# EAGLE design Mecanumbot Power Board (EAGLE 6.2)
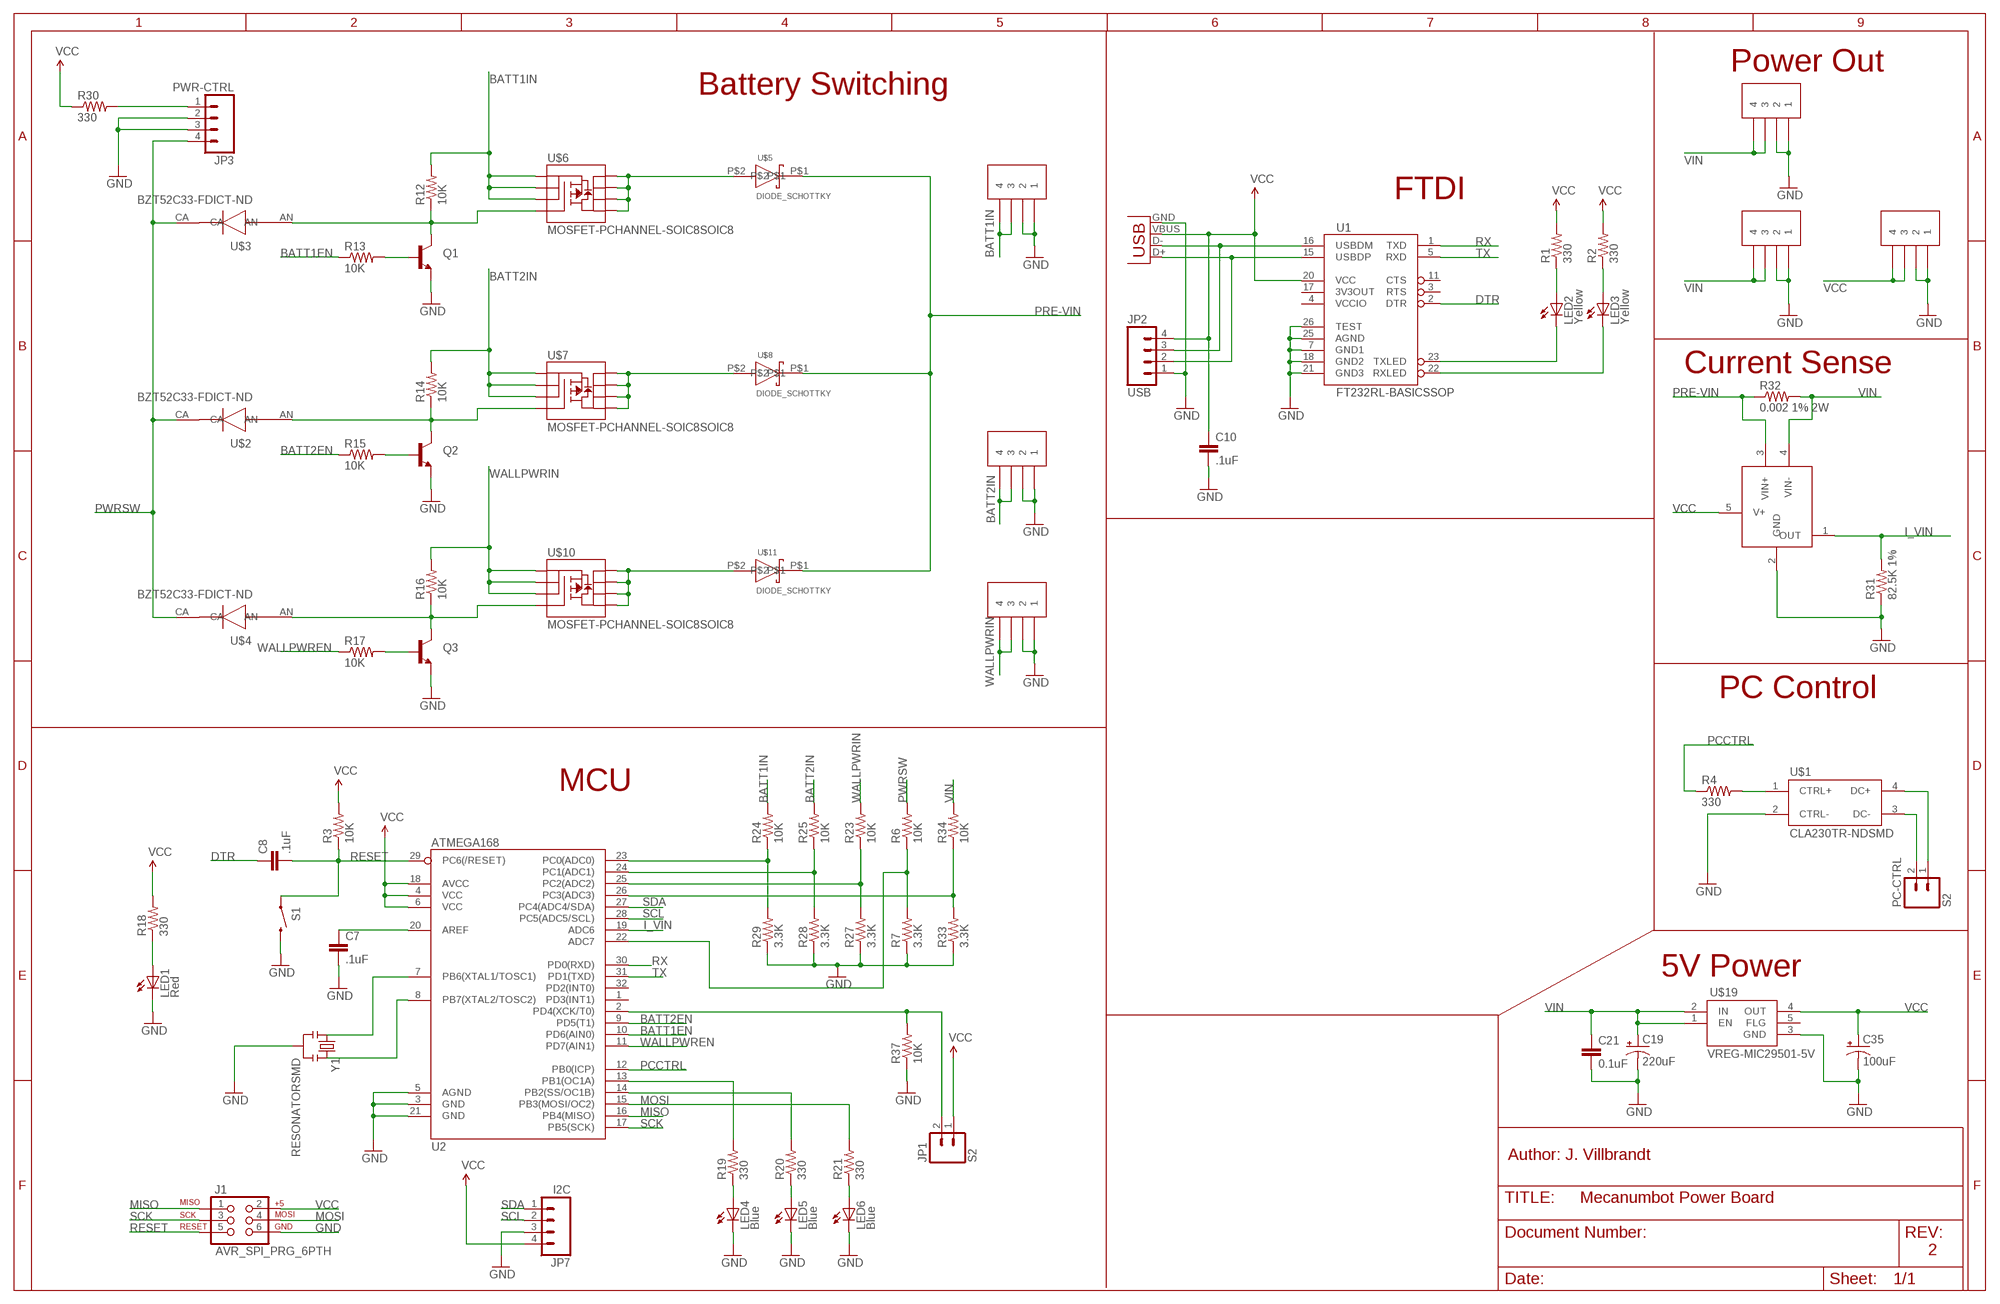
[diagram p0: schematic, sheet 1]

## Parts
C7  .1uF  CAP0603-CAP  [0603-CAP]
C8  .1uF  CAP0603-CAP  [0603-CAP]
C10  .1uF  CAP0603-CAP  [0603-CAP]
C19  220uF  CAP_POLPTH4  [CPOL-RADIAL-1000UF-25V]
C21  0.1uF  CAP1206  [1206]
C35  100uF  CAP_POL1206  [EIA3216]
J1  AVR_SPI_PRG_6PTH  [2X3]
JP1  S2  M02PTH  [1X02]
JP2  USB  M04PTH  [1X04]
JP3  PWR-CTRL  M04PTH  [1X04]
JP7  I2C  M04PTH  [1X04]
LED1  Red  LED0603  [LED-0603]
LED2  Yellow  LED0603  [LED-0603]
LED3  Yellow  LED0603  [LED-0603]
LED4  Blue  LED0603  [LED-0603]
LED5  Blue  LED0603  [LED-0603]
LED6  Blue  LED0603  [LED-0603]
PC-CTRL  S2  M02PTH  [1X02]
Q1  TRANSISTOR_NPNSOT23  [SOT23]
Q2  TRANSISTOR_NPNSOT23  [SOT23]
Q3  TRANSISTOR_NPNSOT23  [SOT23]
R1  330  RESISTOR0603-RES  [0603-RES]
R2  330  RESISTOR0603-RES  [0603-RES]
R3  10K  RESISTOR0603-RES  [0603-RES]
R4  330  RESISTOR0603-RES  [0603-RES]
R6  10K  RESISTOR0603-RES  [0603-RES]
R7  3.3K  RESISTOR0603-RES  [0603-RES]
R12  10K  RESISTOR0603-RES  [0603-RES]
R13  10K  RESISTOR0603-RES  [0603-RES]
R14  10K  RESISTOR0603-RES  [0603-RES]
R15  10K  RESISTOR0603-RES  [0603-RES]
R16  10K  RESISTOR0603-RES  [0603-RES]
R17  10K  RESISTOR0603-RES  [0603-RES]
R18  330  RESISTOR0603-RES  [0603-RES]
R19  330  RESISTOR0603-RES  [0603-RES]
R20  330  RESISTOR0603-RES  [0603-RES]
R21  330  RESISTOR0603-RES  [0603-RES]
R23  10K  RESISTOR0603-RES  [0603-RES]
R24  10K  RESISTOR0603-RES  [0603-RES]
R25  10K  RESISTOR0603-RES  [0603-RES]
R27  3.3K  RESISTOR0603-RES  [0603-RES]
R28  3.3K  RESISTOR0603-RES  [0603-RES]
R29  3.3K  RESISTOR0603-RES  [0603-RES]
R30  330  RESISTOR0603-RES  [0603-RES]
R31  82.5K 1%  RESISTOR0603-RES  [0603-RES]
R32  0.002 1% 2W  RESISTOR2512  [R2512]
R33  3.3K  RESISTOR0603-RES  [0603-RES]
R34  10K  RESISTOR0603-RES  [0603-RES]
R37  10K  RESISTOR0603-RES  [0603-RES]
S1  reset  SWITCH-MOMENTARY-2SMD  [TACTILE_SWITCH_SMD]
U1  FT232RL-BASICSSOP  [SSOP28DB]
U2  ATMEGA168  [TQFP32-08]
U$1  CLA230TR-NDSMD  [4-SOP]
U$2  BZT52C33-FDICT-ND  [SOD-123]
U$3  BZT52C33-FDICT-ND  [SOD-123]
U$4  BZT52C33-FDICT-ND  [SOD-123]
U$5  DIODE_SCHOTTKY  [DO214AB]
U$6  MOSFET-PCHANNEL-SOIC8SOIC8  [SO08]
U$7  MOSFET-PCHANNEL-SOIC8SOIC8  [SO08]
U$8  DIODE_SCHOTTKY  [DO214AB]
U$10  MOSFET-PCHANNEL-SOIC8SOIC8  [SO08]
U$11  DIODE_SCHOTTKY  [DO214AB]
U$12  TERMINAL-4MINIFIT-JR  [MINIFITJR-RGT-4]
U$13  TERMINAL-4MINIFIT-JR  [MINIFITJR-RGT-4]
U$14  TERMINAL-4MINIFIT-JR  [MINIFITJR-RGT-4]
U$16  TERMINAL-4MINIFIT-JR  [MINIFITJR-RGT-4]
U$17  TERMINAL-4MINIFIT-JR  [MINIFITJR-RGT-4]
U$18  TERMINAL-4MINIFIT-JR  [MINIFITJR-RGT-4]
U$19  VREG-MIC29501-5V  [TO263-5]
U$20  INA139/169SOT23-5  [SOT23-5]
X1  USBSMD  [USB-MINIB]
Y1  RESONATORSMD  [RESONATOR-SMD]

## Nets
BATT1EN: R13.1 U2.10(PD6(AIN0))
BATT1IN: R12.2 R24.2 U$6.1(S) U$6.2(S) U$6.3(S) U$12.3 U$12.4
BATT1PREDIODE: U$5.P$2 U$6.5(D) U$6.6(D) U$6.7(D) U$6.8(D)
BATT2EN: R15.1 U2.9(PD5(T1))
BATT2IN: R14.2 R25.2 U$7.1(S) U$7.2(S) U$7.3(S) U$13.3 U$13.4
BATT2PREDIODE: U$7.5(D) U$7.6(D) U$7.7(D) U$7.8(D) U$8.P$2
DTR: C8.1 U1.2(DTR)
GND: C7.2 C10.2 C19.2(-) C21.2 C35.C(-) J1.6 JP2.1 JP3.2 JP3.3 JP7.3 LED1.C LED4.C LED5.C LED6.C Q1.2(E) Q2.2(E) Q3.2(E) R7.1 R27.1 R28.1 R29.1 R31.1 R33.1 R37.1 S1.3 U1.7(GND1) U1.18(GND2) U1.21(GND3) U1.25(AGND) U1.26(TEST) U2.3(GND) U2.5(AGND) U2.21(GND) U$1.2(CTRL-) U$12.1 U$12.2 U$13.1 U$13.2 U$14.1 U$14.2 U$16.1 U$16.2 U$17.1 U$17.2 U$18.1 U$18.2 U$19.3(GND) U$20.2(GND) X1.GND Y1.2
I_VIN: R31.2 U2.19(ADC6) U$20.1(OUT)
MISO: J1.1 U2.16(PB4(MISO))
MOSI: J1.4 R21.2 U2.15(PB3(MOSI/OC2))
N$1: LED2.A R1.1
N$2: LED3.A R2.1
N$3: LED2.C U1.23(TXLED)
N$4: LED3.C U1.22(RXLED)
N$5: PC-CTRL.2 U$1.3(DC-)
N$6: PC-CTRL.1 U$1.4(DC+)
N$7: JP2.3 U1.16(USBDM) X1.D-
N$8: JP2.2 U1.15(USBDP) X1.D+
N$9: C7.1 U2.20(AREF)
N$10: U2.7(PB6(XTAL1/TOSC1)) Y1.1
N$11: U2.8(PB7(XTAL2/TOSC2)) Y1.3
N$12: R4.2 U$1.1(CTRL+)
N$13: JP3.1 R30.2
N$14: R20.2 U2.14(PB2(SS/OC1B))
N$15: R33.2 R34.1 U2.26(PC3(ADC3))
N$16: R19.2 U2.13(PB1(OC1A))
N$20: JP1.2 R37.2 U2.2(PD4(XCK/T0))
N$26: Q1.3(C) R12.1 U$3.AN U$6.4(G)
N$27: Q1.1(B) R13.2
N$29: Q2.3(C) R14.1 U$2.AN U$7.4(G)
N$30: Q2.1(B) R15.2
N$31: LED1.A R18.1
N$32: Q3.3(C) R16.1 U$4.AN U$10.4(G)
N$33: Q3.1(B) R17.2
N$38: LED6.A R21.1
N$39: LED4.A R19.1
N$40: LED5.A R20.1
N$42: R23.1 R27.2 U2.25(PC2(ADC2))
N$43: R25.1 R28.2 U2.24(PC1(ADC1))
N$44: R24.1 R29.2 U2.23(PC0(ADC0))
N$46: R6.1 R7.2 U2.22(ADC7)
PCCTRL: R4.1 U2.12(PB0(ICP))
PRE-VIN: R32.1 U$5.P$1 U$8.P$1 U$11.P$1 U$20.3(VIN+)
PWRSW: JP3.4 R6.2 U$2.CA U$3.CA U$4.CA
RESET: C8.2 J1.5 R3.1 S1.1 U2.29(PC6(/RESET))
RX: U1.1(TXD) U2.30(PD0(RXD))
SCK: J1.3 U2.17(PB5(SCK))
SCL: JP7.2 U2.28(PC5(ADC5/SCL))
SDA: JP7.1 U2.27(PC4(ADC4/SDA))
TX: U1.5(RXD) U2.31(PD1(TXD))
VCC: C10.1 C35.A(+) J1.2 JP1.1 JP2.4 JP7.4 R1.2 R2.2 R3.2 R18.2 R30.1 U1.20(VCC) U2.4(VCC) U2.6(VCC) U2.18(AVCC) U$18.3 U$18.4 U$19.4(OUT) U$20.5(V+) X1.VBUS
VIN: C19.1(+) C21.1 R32.2 R34.2 U$16.3 U$16.4 U$17.3 U$17.4 U$19.1(EN) U$19.2(IN) U$20.4(VIN-)
WALLPWREN: R17.1 U2.11(PD7(AIN1))
WALLPWRIN: R16.2 R23.2 U$10.1(S) U$10.2(S) U$10.3(S) U$14.3 U$14.4
WALLPWRPREDIODE: U$10.5(D) U$10.6(D) U$10.7(D) U$10.8(D) U$11.P$2
Unconnected: U1.3(RTS) U1.11(CTS) U1.17(3V3OUT) U2.1(PD3(INT1)) U2.32(PD2(INT0)) U$19.5(FLG)

## Notes on the sheet
- Power Out
- Battery Switching
- FTDI
- Current Sense
- PC Control
- MCU
- 5V Power
- Author: J. Villbrandt
- 2

## Power pins joined to a net without a drawn wire
VCCIO: U1.4(VCCIO)

## Library data of the parts
C7 C8 C10 = SparkFun:CAP: Capacitor Standard 0603 ceramic capacitor, and 0.1" leaded capacitor.
C19 = SparkFun2:CAP_POL: Capacitor Polarized These are standard SMD and PTH capacitors. Normally 10uF, 47uF, and 100uF in electrolytic and tantalum varieties. Always verify the external diameter of the through hole cap, it varies with capacity, voltage, and manufacturer. The EIA devices should be standard.
C21 = SparkFun2:CAP: Capacitor Standard 0603 ceramic capacitor, and 0.1" leaded capacitor.
C35 = SparkFun:CAP_POL: Capacitor Polarized These are standard SMD and PTH capacitors. Normally 10uF, 47uF, and 100uF in electrolytic and tantalum varieties. Always verify the external diameter of the through hole cap, it varies with capacity, voltage, and manufacturer. The EIA devices should be standard.
J1 = SparkFun:AVR_SPI_PRG_6: AVR ISP 6 Pin This is the reduced ISP connector for AVR programming. Common on Arduino. This footprint will take up less PCB space and can be used with a 10-pin to 6-pin adapter such as SKU: BOB-08508
JP1 PC-CTRL = SparkFun:M02: Header 2 Standard 2-pin 0.1" header. Use with straight break away headers (SKU : PRT-00116), right angle break away headers (PRT-00553), swiss pins (PRT-00743), machine pins (PRT-00117), and female headers (PRT-00115). Molex polarized connector foot print use with SKU : PRT-08233 with associated crimp pins and housings.
JP2 JP3 JP7 = SparkFun:M04: Header 4 Standard 4-pin 0.1" header. Use with straight break away headers (SKU : PRT-00116), right angle break away headers (PRT-00553), swiss pins (PRT-00743), machine pins (PRT-00117), and female headers (PRT-00115). Molex polarized connector foot print use with SKU : PRT-08231 with associated crimp pins and housings. 1MM SMD Version SKU: PRT-10208
LED1-LED6 = SparkFun:LED: LEDs Standard schematic elements and footprints for 5mm, 3mm, 1206, and 0603 sized LEDs. 5mm - Spark Fun Electronics SKU : COM-00529 (and others)
Q1-Q3 = SparkFun:TRANSISTOR_NPN: Transistor NPN BJT configuration in SOT23 package. MMBT2222 is the common NPN we use. Double check BCE configuration again layout.
R1-R4 R6 R7 R12-R21 R23-R25 R27-R34 R37 = SparkFun:RESISTOR: Resistor Basic schematic elements and footprints for 0603, 1206, and PTH resistors.
S1 = SparkFun:SWITCH-MOMENTARY-2
U1 = SparkFun:FT232RL-BASIC: USB UART This is the simplified version of the FT232RL unit. Only what you need, nothing you don't. Spark Fun Electronics SKU : COM-00650
U2 = SparkFun:ATMEGA168
U$1 = jav-parts:CLA230TR-ND: Digi-Key part: CLA230TR-ND http://www.digikey.com/product-detail/en/CPC1002NTR/CLA230TR-ND/1023460 http://www.clare.com/home/pdfs.nsf/www/CPC1002N.pdf/$file/CPC1002N.pdf
U$2-U$4 = jav-parts:BZT52C33-FDICT-ND: 33V Zener Diode, 500mW Digi-Key part: BZT52C33-FDICT-ND http://www.digikey.com/product-detail/en/BZT52C33-7-F/BZT52C33-FDICT-ND/717852 http://www.diodes.com/datasheets/ds18004.pdf
U$5 U$8 U$11 = AT-Parts-RJ:DIODE_SCHOTTKY
U$6 U$7 U$10 = SparkFun:MOSFET-PCHANNEL-SOIC8
U$12-U$14 U$16-U$18 = AT-Parts-RJ:TERMINAL-4
U$19 = RJehangir:VREG-MIC29501-5V
U$20 = AT-Parts-RJ:INA139/169: TI High-Side Measurement: CURRENT SHUNT MONITOR
X1 = SparkFun:USB: USB Connectors USB-B-PTH is fully proven SKU : PRT-00139 USB-miniB is fully proven SKU : PRT-00587 USB-A-PCB is untested. USB-A-H is throughly reviewed, but untested. Spark Fun Electronics SKU : PRT-00437 USB-B-SMT is throughly reviewed, but untested. Needs silkscreen touching up. USB-A-S has not been used/tested USB-MB-H has not been used/tested
Y1 = SparkFun:RESONATOR: Resonator Small SMD resonator. This is the itty bitty 10/20MHz resonators with built in caps. CSTCE10M0G55 and CSTCE20M0V53. Footprint has been reviewed closely but hasn't been tested yet.

## Board
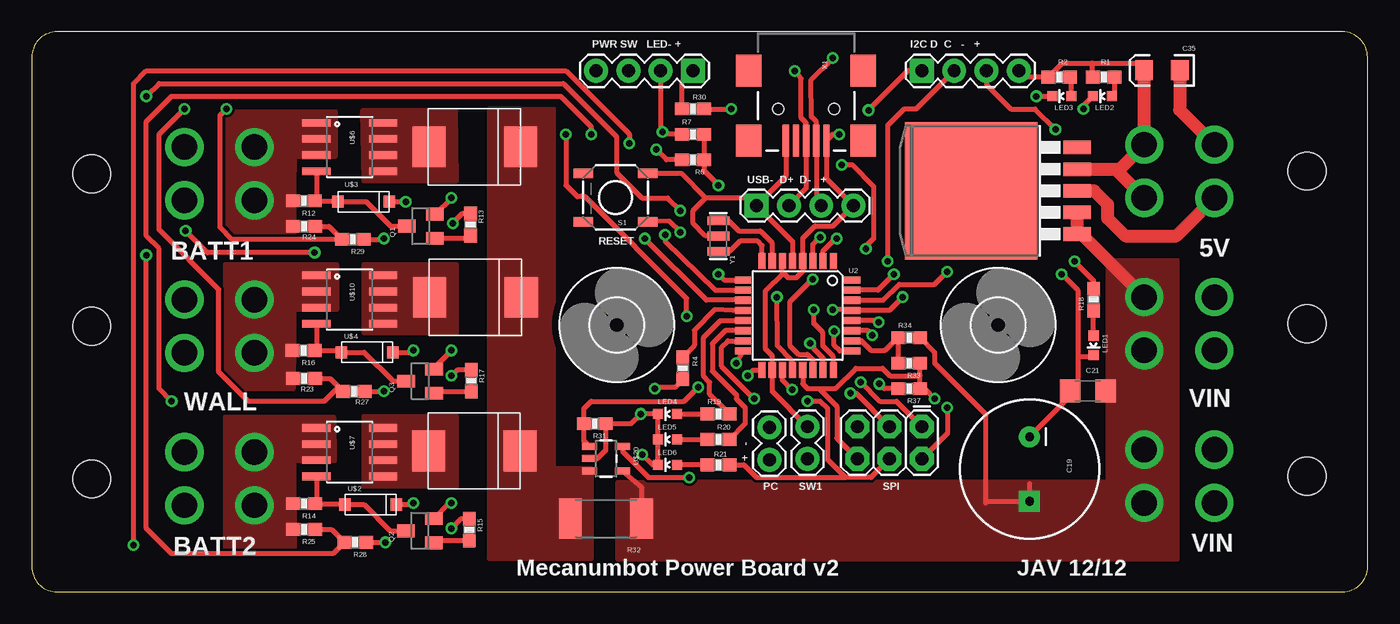
[diagram p1: board, top side]
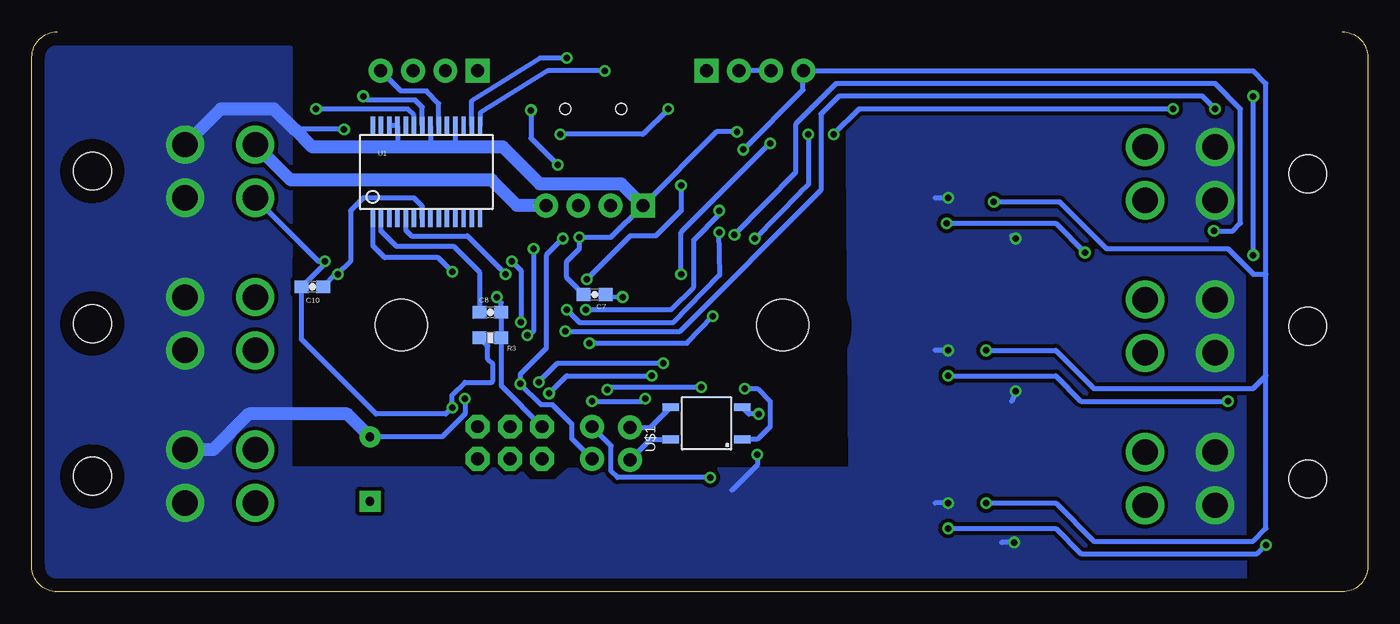
[diagram p2: board, bottom side, seen from below]

Size 105.06 x 44.07 mm. Coordinates in mm from the lower left corner, seen from the top.
Outline: 2,44.07 arc90 0,42.07 0,2 arc90 2,0 103.06,0 arc90 105.06,1.99 105.05,42.08 arc90 103.05,44.07
Copper layers (1*16): Top 0.035mm / dielectric 1.5mm / Bottom 0.035mm
Design rules: minimum track width 10mil, minimum drill 15mil, track to track 8mil, track to pad 8mil, pad to pad 8mil, via to via 8mil, smd to smd 8mil, copper to edge 40mil, drill to drill 8mil, minimum pad ring 10mil, minimum via ring 8mil, stop-mask expansion 4mil, vias tented up to drill 0mil, thermal gap 10mil

### Footprints (pad centres in the part's own frame; a part is rotated, then mirrored left to right if it is on the bottom)
0603-CAP = smd 1.1 x 1: 1 -0.85,0; 2 0.85,0
CPOL-RADIAL-1000UF-25V = drill 0.7 pad 1.651 square: 1 2.54,0 | drill 0.7 pad 1.651: 2 -2.54,0
1206 = smd 1.6 x 1.8: 1 -1.4,0; 2 1.4,0
EIA3216 = smd 1.4 x 1.6: A 1.4,0; C -1.4,0
2X3 = drill 1.016 pad 1.88 octagon: 1 0,0; 2 0,2.54; 3 2.54,0; 4 2.54,2.54; 5 5.08,0; 6 5.08,2.54
1X02 = drill 1.016 pad 1.88: 1 0,0; 2 2.54,0
1X04 = drill 1.016 pad 1.88 square: 1 0,0 | drill 1.016 pad 1.88: 2 2.54,0; 3 5.08,0; 4 7.62,0
LED-0603 = smd 0.8 x 0.8: A 0,-0.75; C 0,0.75
SOT23 = smd 1 x 1.4: 1 -0.95,-1.1; 2 0.95,-1.1; 3 0,1.1
0603-RES = smd 1.1 x 1: 1 -0.85,0; 2 0.85,0
R2512 = smd 1.8 x 3.2: 1 -2.8,0; 2 2.8,0
TACTILE_SWITCH_SMD = smd 1.524 x 0.762: 1 -2.54,1.905; 2 2.54,1.905; 3 -2.54,-1.905; 4 2.54,-1.905
SSOP28DB = smd 0.348 x 1.397: 1 -4.225,-3.656; 2 -3.575,-3.656; 3 -2.925,-3.656; 4 -2.275,-3.656; 5 -1.625,-3.656; 6 -0.975,-3.656; 7 -0.325,-3.656; 8 0.325,-3.656; 9 0.975,-3.656; 10 1.625,-3.656; 11 2.275,-3.656; 12 2.925,-3.656; 13 3.575,-3.656; 14 4.225,-3.656; 15 4.225,3.656; 16 3.575,3.656; 17 2.925,3.656; 18 2.275,3.656; 19 1.625,3.656; 20 0.975,3.656; 21 0.325,3.656; 22 -0.325,3.656; 23 -0.975,3.656; 24 -1.625,3.656; 25 -2.275,3.656; 26 -2.925,3.656; 27 -3.575,3.656; 28 -4.225,3.656
TQFP32-08 = smd 1.27 x 0.559: 1 -4.293,2.8; 2 -4.293,2; 3 -4.293,1.2; 4 -4.293,0.4; 5 -4.293,-0.4; 6 -4.293,-1.2; 7 -4.293,-2; 8 -4.293,-2.8; 17 4.293,-2.8; 18 4.293,-2; 19 4.293,-1.2; 20 4.293,-0.4; 21 4.293,0.4; 22 4.293,1.2; 23 4.293,2; 24 4.293,2.8 | smd 0.559 x 1.27: 9 -2.8,-4.293; 10 -2,-4.293; 11 -1.2,-4.293; 12 -0.4,-4.293; 13 0.4,-4.293; 14 1.2,-4.293; 15 2,-4.293; 16 2.8,-4.293; 25 2.8,4.293; 26 2,4.293; 27 1.2,4.293; 28 0.4,4.293; 29 -0.4,4.293; 30 -1.2,4.293; 31 -2,4.293; 32 -2.8,4.293
4-SOP = smd 0.6 x 1.3: 1 0,-2.8; 2 2.54,-2.8; 3 2.54,2.8; 4 0,2.8
SOD-123 = smd 0.9 x 0.95: AN -2.025,0; CA 2.025,0
DO214AB = smd 2.6 x 3.2: P$1 0,0; P$2 7.2,0
SO08 = smd 0.61 x 2.21: 1 -1.905,-2.616; 2 -0.635,-2.616; 3 0.635,-2.616; 4 1.905,-2.616; 5 1.905,2.616; 6 0.635,2.616; 7 -0.635,2.616; 8 -1.905,2.616
MINIFITJR-RGT-4 = drill 2: 1 4.191,0; 2 0,0; 3 4.191,5.512; 4 0,5.512 | hole 2.997: 2.108,-7.29
TO263-5 = smd 1.067 x 2.159: 1 -3.404,-5.791; 2 -1.702,-5.791; 3 0,-5.791; 4 1.702,-5.791; 5 3.404,-5.791 | smd 10.8 x 10.41: 6 0,2.54
SOT23-5 = smd 0.55 x 1.2: 1 -0.95,-1.3; 2 0,-1.3; 3 0.95,-1.3; 4 0.95,1.3; 5 -0.95,1.3
4,1 = hole 4.1: 0,0
USB-MINIB = smd 2.5 x 0.5: D+ 2.5,0; D- 2.5,0.8; GND 2.5,-1.6; ID 2.5,-0.8; VBUS 2.5,1.6 | smd 2.5 x 2: GND@1 -3,-4.5; GND@2 -3,4.5; GND@3 2.5,4.5; GND@4 2.5,-4.5 | hole 0.9: 0,2.2; 0,-2.2
RESONATOR-SMD = smd 0.7 x 1.7: 1 -1.2,0; 2 0,0; 3 1.2,0

### Placement (x,y rotation side)
C7  60.8,23.4 180 bottom
C8  69,22 0 bottom
C10  83,24 0 bottom
C19  78.47,9.67 270 top
C21  83.05,15.8 180 top
C35  88.87,41.04 180 top
J1  70,13 180 top
JP1  61,13 270 top
JP2  57,30.4 0 top
JP3  52,41 180 top
JP7  70,41 0 top
LED1  83.5,19.4 180 top
LED2  84.2,39 90 top
LED3  81,39 90 top
LED4  50,14 90 top
LED5  50,12 90 top
LED6  50,10 90 top
PC-CTRL  58,10.4 90 top
Q1  30.6,28.78 90 top
Q2  30.52,4.81 90 top
Q3  30.54,16.58 90 top
R1  84.3,40.5 180 top
R2  80.8,40.5 180 top
R3  69,20 180 bottom
R4  51.2,17.6 270 top
R6  52,34 180 top
R7  52,36 0 top
R12  21.4,30.76 180 top
R13  34.5,28.9 270 top
R14  21.42,6.94 180 top
R15  34.42,4.89 270 top
R16  21.38,19 180 top
R17  34.56,16.61 270 top
R18  83.5,23 90 top
R19  54,14 0 top
R20  54,12 0 top
R21  54,10 0 top
R23  21.42,16.79 180 top
R24  21.42,28.76 180 top
R25  21.42,4.92 180 top
R27  25.34,15.78 180 top
R28  25.44,3.91 180 top
R29  25.25,27.74 180 top
R30  52,38 180 top
R31  44.28,13.24 180 top
R32  45.15,5.77 0 top
R33  69,18 180 top
R34  69,20 0 top
R37  69,16 180 top
S1  45.91,31.03 180 top
U1  74.03,33.04 0 bottom
U2  60.23,21.75 270 top
U$1  52,12 90 bottom
U$2  26.65,6.87 0 top
U$3  26.1,30.7 0 top
U$4  26.36,18.85 0 top
U$5  38.43,35.02 180 top
U$6  25,35 270 top
U$7  25,11 270 top
U$8  38.41,11.1 180 top
U$10  25,23 270 top
U$11  38.5,23.18 180 top
U$12  12,35 270 top
U$13  12,11 270 top
U$14  12,23 270 top
U$16  93,7 90 top
U$17  93,19 90 top
U$18  93,31 90 top
U$19  76.41,31.56 90 top
U$20  45.16,10.49 270 top
U$24  [4,1]  76,21 0 top
U$26  [4,1]  46,21 0 top
X1  60.9,38.01 270 top
Y1  54,28 270 top

### Tracks (layer width: path | path; a pad name or v marks a point on that pad's centre or on a via)
BATT1EN  (via drill 0.51)
  Top 0.406: R13.1 33.85,29.75 v33.1,29 | v22.24,26.7 13.8,26.7 v12.1,28.4 | v49.8,28.1 49.8,27.6 53.75,23.75 U2.10
  Bottom 0.406: v33.1,29 24.54,29 v22.24,26.7 | v12.1,28.4 10.6,28.4 10,29 10,38 12,40 41.8,40 45,36.8 45,33 v49.8,28.1
BATT1IN
  pour Top (no thermals): 15.24,37.8 23.86,37.8 23.86,34.26 20.65,34.25 20.6,31.78 20.6,28.1 15.24,28.07
BATT1PREDIODE
  pour Top (no thermals): 26.03,37.9 33.28,37.9 33.38,32.33 26.13,32.33
BATT2EN  (via drill 0.51)
  Top 0.406: R15.1 33.74,5.74 v33,5 | v8,3.7 8,40 9,41 42,41 47,36 v47,35.3 | v54,25 54.45,24.55 U2.9
  Bottom 0.406: v33,5 24.54,5 22.54,3 8.7,3 v8,3.7 | v47,35.3 54,28.3 v54,25
BATT2IN
  pour Top (no thermals): 15.24,13.79 23.73,13.79 23.76,10.25 20.6,10.3 20.65,3.22 15.24,3.22
BATT2PREDIODE
  pour Top (no thermals): 26.13,13.82 33.38,13.82 33.38,8.32 26.13,8.32
DTR
  Bottom 0.406: U1.2 77.6,28.38 77.6,28.4 76.4,27.2 71.9,27.2 69.85,25.15 C8.1
GND  (via drill 0.51)
  Top 0.406: Q2.2 32.86,7 v33,7 | R28.1 27.91,3.91 v27.8,3.9 | Q3.2 31.64,17.64 v33,19 | R27.1 27.78,15.78 v27.7,15.8 | Q1.2 31.73,29.73 v33,31 | R29.1 27.64,27.74 v27.7,27.8 | U$20.2 44.49,10.49 45.13,11.13 R31.1 47.14,13.24 v47.9,14 LED4.C LED5.C LED6.C 48.8,10 v48,10.8 | X1.GND 59.3,32.7 JP2.1 | JP2.1 59.83,27.57 U2.5 | C19.2 81.57,15.32 C21.2 82.3,16.45 82.3,18.5 | 82.3,18.5 82.3,23.7 v81,25 81.15,25 | v71,15.2 70.2,16 R37.1 69.85,17 | JP7.3 75.08,39.92 77,38 78.9,38 v80.5,36.4 | JP3.2 49.46,36.34 v49.6,36.2 49.8,36 R7.1 | U2.3 61.43,27.33 v62,27.9 | U2.21 60.63,16.37 61,16 61.9,16 | 61.9,16 63.3,14.6 63.3,12.08 J1.6 | S1.3 51.06,32.94 53,31 | 69.85,17 R33.1 | LED1.C 83.35,18.5 82.3,18.5 | Y1.2 53,28 52,29 52,30 53,31 | JP2.1 56.4,31 53,31 | 61.9,16 63.2,16 64.8,17.6 66.9,17.6 67.5,17 69.85,17
  Top 1.016: U$19.3 83.54,31.56 84.6,30.5 84.6,29.4 86,28 90,28 U$18.2 | C35.C 90.27,37.92 U$18.1
  Bottom 0.406: v33,7 34,7 | v27.8,3.9 28.8,3.9 | v33,19 34,19 | v27.7,15.8 28,15 | v33,31 34,31 | v27.7,27.8 27.8,27.8 28,28 | JP3.3 JP3.2 | U1.26 U1.25 76.3,35.3 76,35 | v71,15.2 71,14 72.79,12.21 C19.2 | U1.18 71.75,35.25 68,35 | U1.21 73.7,35.3 74,35 | v80.5,36.4 84.4,36.4 | U1.7 74.35,30.35 75,31 79,31 80,30 80,26 v81,25 81.15,25 C10.2 | v49.6,36.2 51.2,36.2 JP2.1 59.5,27.9 v62,27.9 62,27 63,26 63,24.75 C7.2 | v48,10.8 48,10 50,8 | v47.9,14 48.66,14 U$1.2
  Bottom 1.016: C19.2 80.26,14 88,14 90.81,11.19 U$16.1 | JP2.1 58.7,32.1 65.1,32.1 68,35 74,35 76,35 83,35 84.4,36.4 86,38 90.19,38 U$18.1
  pour Bottom (isolate 0.305, no thermals): 84.67,42.8 105.92,42.8 105.69,-0.23 9.63,-1.23 9.73,33.73 10,44 41,44 40.7,9.7 62.9,9.6 63.9,8.7 65.9,8.7 66.8,9.7 84.7,9.7
I_VIN  (via drill 0.51)
  Top 0.406: U$20.1 43.43,11.87 R31.2 43.43,14.43 44,15 51.3,15 v52.4,16.1 | v59.8,15.9 59.03,16.67 U2.19
  Bottom 0.406: v52.4,16.1 59.6,16.1 v59.8,15.9
MISO  (via drill 0.51)
  Top 0.406: J1.1 68,15 66.7,15 v65.19,16.51 | v55.4,18 55.94,18.94 U2.16
  Bottom 0.406: v65.19,16.51 63.7,18 v55.4,18
MOSI  (via drill 0.51)
  Top 0.406: J1.4 66,9 64,9 | 64,9 62.6,10.4 62.6,14.4 62,15 v61,15 | v56.8,15.2 54.25,17.75 54.25,19.25 54.75,19.75 U2.15 | R21.2 56,10 57,9 64,9
  Bottom 0.406: v61,15 57,15 v56.8,15.2
N$1
  Top 0.406: R1.1 85.15,39.4 LED2.A
N$2
  Top 0.406: LED3.A 81.75,40.4 R2.1
N$3  (via drill 0.51)
  Top 0.406: v82.7,38 82.7,38.25 LED2.C
  Bottom 0.406: U1.23 75,37.5 75.5,38 v82.7,38
N$4  (via drill 0.51)
  Top 0.406: v79,39 LED3.C
  Bottom 0.406: U1.22 74.35,38.15 74.9,38.7 78.7,38.7 v79,39
N$5
  Bottom 0.406: PC-CTRL.2 56.4,12.94 U$1.3
N$6
  Bottom 0.406: PC-CTRL.1 56.4,12 U$1.4
N$7  (via drill 0.51)
  Top 0.406: JP2.3 61.7,30.79 X1.D- 61.7,37.01 61.3,37.4 61.3,40.3 v63,42
  Bottom 0.406: v63,42 65.1,42 70.5,38.6 70.5,36.75 U1.16
N$8  (via drill 0.51)
  Top 0.406: JP2.2 60.9,31.75 X1.D+ 60.9,36.91 60.5,37.3 60.49,40.41 v60,41
  Bottom 0.406: v60,41 64.5,41 69.8,37.7 U1.15
N$9  (via drill 0.51)
  Top 0.406: U2.20 59.8,18.2 58.63,19.37 58.63,19.43 v58.6,23.2
  Bottom 0.406: v58.6,23.2 59.7,23.15 C7.1
N$10
  Top 0.406: Y1.1 54.8,29.2 55.6,28.4 57.3,28.4 58.2,27.5 58.2,26.07 U2.7
N$11
  Top 0.406: U2.8 57.43,27.27 57.1,27.6 55.7,27.6 54.9,26.8 Y1.3
N$12  (via drill 0.51)
  Top 0.406: R4.2 50.6,16.1 49.1,16.1 v49,16
  Bottom 0.406: v49,16 48,16 47,15 47,13 48,12 U$1.1
N$13
  Top 0.406: R30.2 51.15,40.15 JP3.1
N$14
  Top 0.406: U2.14 54.55,20.55 53.53,19.53 53.53,17.37 55.4,15.5 55.4,15.2 56.1,14.5 56.1,13.25 R20.2
N$15
  Top 0.406: U2.26 65.25,19.75 66,19 67.1,19 68.1,20 R34.1 R33.2
N$16
  Top 0.406: R19.2 53.3,15.55 53.3,16.5 52.83,16.97 52.83,20.03 54.15,21.35 U2.13
N$20  (via drill 0.51)
  Top 0.406: R37.2 67.75,16.05 67.82,16 67.02,16 v66.65,16.36 | U2.2 62.23,26.83 63.2,27.8 v63.3,27.8
  Bottom 0.406: v63.3,27.8 64.6,26.5 64.6,19.16 66.65,17.11 v66.65,16.36 65.02,14.73 64.14,14.73 62.6,13.2 62.6,12.06 JP1.2
N$26
  Top 0.406: U$6.4 22.38,30.89 R12.1 24.02,30.76 U$3.AN 26.3,30.7 28.22,28.78 Q1.3
N$27
  Top 0.406: Q1.1 34.28,27.83 R13.2
N$29
  Top 0.406: U$7.4 22.38,7.05 R14.1 24.55,6.94 U$2.AN 26.13,6.87 28.19,4.81 Q2.3
N$30
  Top 0.406: Q2.1 31.8,4.04 R15.2
N$31
  Top 0.406: 83.55,22.1 R18.1 LED1.A
N$32
  Top 0.406: Q3.3 28.42,16.58 26.15,18.85 U$4.AN 24.18,19 R16.1 22.38,19.15 U$10.4
N$33
  Top 0.406: Q3.1 31.77,15.76 R17.2
N$38
  Top 0.406: R21.1 LED6.A
N$39
  Top 0.406: LED4.A R19.1
N$40
  Top 0.406: LED5.A R20.1
N$42  (via drill 0.51)
  Top 0.406: R23.1 23.48,16.79 R27.2 24.27,16 24,16 23,15 17,15 14.7,17.3 14.7,23.8 10,28.5 10,36 v12,38 | U2.25 63.55,18.95 63.1,19.4 v63.1,20.5
  Bottom 0.406: v12,38 13,39 41.6,39 43,37.6 43,31.6 54.1,20.5 v63.1,20.5
N$43  (via drill 0.51)
  Top 0.406: R28.2 | R25.1 23.58,4.92 R28.2 | R28.2 23.68,3 11,3 9,5 v9,26.5 | U2.24 63.03,18.52 62.2,19.35 62.2,20.4 61.5,21.1 v61.5,22.2 | v9,39 10,40 41.8,40 46,35.8 46,33 48,31 50,31 v51,30
  Bottom 0.406: v61.5,22.2 54.8,22.2 53,24 53,27.7 51,29.7 v51,30 | v9,26.5 v9,39
N$44  (via drill 0.51)
  Top 0.406: R24.1 23.38,28.76 R29.2 15.76,27.74 14.8,28.7 14.8,37.5 v15.3,38 | U2.23 62.23,18.4 61.5,19.13 61.5,19.3 v61.2,19.57 | v51.5,21.7 51.5,23.1 43.5,31.1 42.9,31.1 42,32 v42,36
  Bottom 0.406: v15.3,38 40,38 v42,36 | v61.2,19.57 53.53,19.57 v51.5,21.7
N$46  (via drill 0.51)
  Top 0.406: R7.2 R6.1 52.85,33.15 v54,32 | U2.22 61.4,17.7 61.4,18.3 61,18.7 60.3,18.7 59.6,19.4 59.6,22.8 v61.4,24.6
  Bottom 0.406: v54,32 54,30 56,28 58,28 v61.4,24.6
PCCTRL
  Top 0.406: U2.12 55.15,22.15 53.7,22.2 52.1,20.6 52.1,19.4 R4.1
PRE-VIN
  pour Top (no thermals): 44,2.62 36,2.62 36,38 41,38 41,9.7 44,9.7
PWRSW  (via drill 0.51)
  Top 0.406: U$2.CA 29.87,6.87 v30,7 | U$4.CA 29.85,18.85 v30,19 | U$3.CA v29.4,30.7 | R6.2 49.9,34 v49.1,34.8
  Bottom 0.406: v30,7 24.54,7 21.54,4 9,4 8,5 8,17 | 8,17 8,25 | 8,25 8,40 9,41 JP3.4 44.4,40.98 44.4,39.5 v49.1,34.8 | v30,19 24.54,19 21.54,16 9,16 8,17 | v29.4,30.7 24.24,30.7 20.54,27 11,27 9,25 8,25
RESET  (via drill 0.51)
  Top 0.406: v68.5,23.2 67.45,22.15 U2.29 64.47,22.2 v63,22.2 | v51,28.3 50.12,29.18 S1.1
  Bottom 0.406: v68.5,23.2 68.15,22.75 C8.2 R3.1 68.15,16.23 J1.5 | v63,22.2 62,21.2 54.6,21.2 51,24.9 50.95,24.93 v51,28.3
RX  (via drill 0.51)
  Top 0.406: U2.30 66.95,22.95 68.2,24.2 71,24.2 v72,25.2
  Bottom 0.406: v72,25.2 73.1,26.3 77.3,26.3 78.25,27.25 U1.1
SCK  (via drill 0.51)
  Top 0.406: J1.3 64.84,15.62 v64.38,15.62 | v56.3,17 56.74,17.46 U2.17
  Bottom 0.406: v64.38,15.62 63,17 v56.3,17
SCL  (via drill 0.51)
  Top 0.406: JP7.2 69.54,38 68.6,38 67.3,36.7 v67.3,26 | v66.6,21.23 66.35,21.35 U2.28
  Bottom 0.406: v67.3,26 66.6,25.3 v66.6,21.23
SDA  (via drill 0.51)
  Top 0.406: v65.6,27 65.6,27.2 66.2,27.8 66.2,31.9 64.5,33.6 v63.7,33.6 | v66.1,20.2 65.75,20.55 U2.27 | JP7.1 68.9,41 v65.8,37.9
  Bottom 0.406: v65.6,27 65.6,20.5 65.9,20.2 v66.1,20.2 | v65.8,37.9 65.8,35.7 v63.7,33.6
TX  (via drill 0.51)
  Top 0.406: v67.8,25 66.55,23.75 U2.31
  Bottom 0.406: U1.5 75.65,28.45 75.2,28 70.8,28 v67.8,25
VCC  (via drill 0.51)
  Top 0.406: 82,25.85 v82,26 83.5,24.5 R18.2 | JP7.4 78.12,40.5 R2.2 81.05,41.6 83.4,41.6 | 83.5,40.5 R1.2 83.4,40.55 83.4,41.6 | R30.1 v55,38 | v63.5,36 62.99,36 X1.VBUS 62.49,32.52 JP2.4 63.02,28.8 61.6,28.8 60.63,27.83 U2.4 60.63,25.23 60.1,24.7 59.5,24.7 59.1,25.1 | 59.1,25.1 59,25.2 59,26.01 U2.6 | v72,14.5 72,12.46 J1.2 | U$20.5 46.46,11.04 47.2,10.3 48.5,9 v51.7,9 | 60.9,13 JP1.1 58.23,15.77 U2.18 58.23,18.57 57.7,19.1 57.7,23.7 59.1,25.1 | 83.4,41.6 87.2,41.6 87.47,41.33 C35.A
  Top 1.016: U$18.4 85.23,33.26 U$19.4 85.56,33.26 U$18.3 87.47,35.21 C35.A
  Bottom 0.406: 83.85,23.85 C10.1 | U$18.4 82.49,26 v82,26 82,25.85 C10.1 | U1.20 73.05,38.43 74,39.4 76.02,39.4 JP7.4 | v55,38 57,36 v63.5,36 | v51.7,9 59,9 59.5,9.5 59.5,11.5 JP1.1 | R3.2 69.2,19.35 69.2,18.3 68.8,17.9 68.8,16.6 68.9,16.5 71,16.5 72,15.5 v72,14.5 72.5,14 78,14 83.85,19.85 C10.1
  Bottom 1.016: JP2.4 66.9,30.4 68.9,32.4 84.7,32.4 U$18.3
VIN
  Top 0.406: U$20.4 47.95,8.25 R32.2 | 78.47,8.53 C19.1 75.13,7.13 75,7 75,14 71,18 71,18.85 R34.2
  Top 1.016: U$19.2 U$19.1 82.52,28.16 U$17.3
  pour Top (no thermals): 45.99,8.65 45.99,2.54 90.17,2.54 90.17,26.13 84.55,26.13 84.55,8.68 48.26,8.68
WALLPWREN  (via drill 0.51)
  Top 0.406: R17.1 33.46,17.46 v33,17 | v11,15 10,16 10,27 9,28 9,37 11,39 41.6,39 44,36.6 v44,36 | v48.2,27.8 53.05,22.95 U2.11
  Bottom 0.406: v33,17 24.54,17 22.54,15 v11,15 | v48.2,27.8 44.64,31.4 44,32.04 v44,36
WALLPWRIN
  pour Top (no thermals): 15.24,25.77 23.96,25.77 23.99,22.24 21.4,22.2 20.49,22.24 20.61,22.15 20.6,19.85 20.55,15.96 15.24,15.99
WALLPWRPREDIODE
  pour Top (no thermals): 26.13,25.77 33.38,25.77 33.38,20.39 26.13,20.39

### Text on the board
tPlace: PWR SW LED- + | I2C D C - + | USB- D+ D- + | RESET | BATT1 | 5V | VIN | WALL | + - | PC | SW1 | SPI | BATT2 | VIN | Mecanumbot Power Board v2 | JAV 12/12